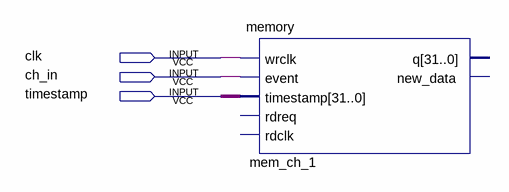
[diagram p0: schematic sheet]
// Quartus schematic channel_path.bdf as structural Verilog: 1 symbols, 3 pins
module channel_path (
  input  clk,
  input  ch_in,
  input  timestamp
);

  wire [31:0] undriven;

  memory mem_ch_1 (.wrclk(clk), .\event (ch_in), .timestamp(undriven));  // open: rdreq, rdclk, q, new_data
endmodule
